# EasyEDA Pro project PRJ_Feeder_V01b.epro, board Host
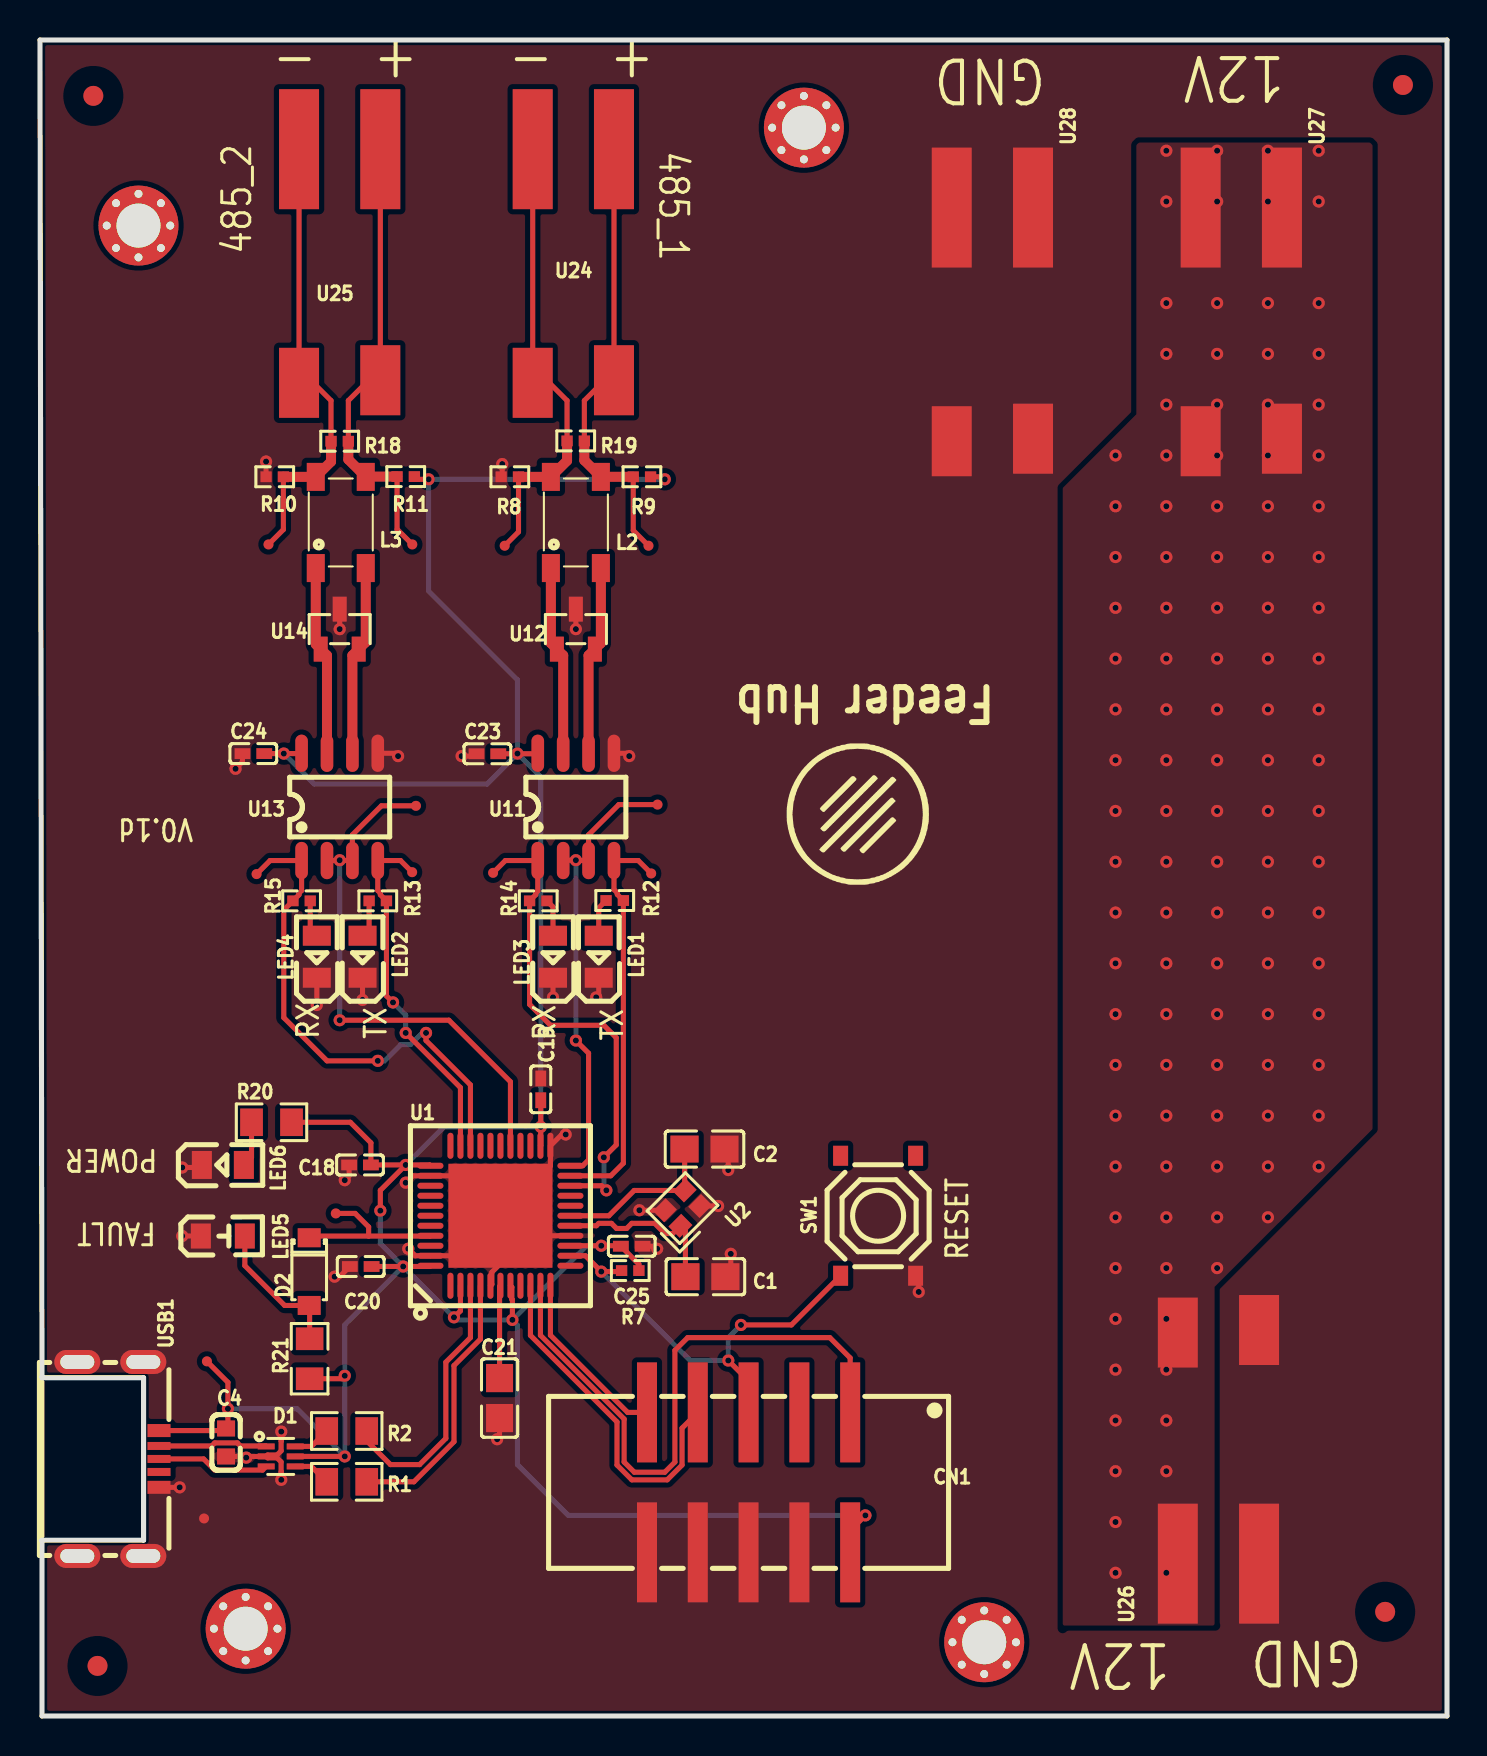
[diagram p14: board, top side]
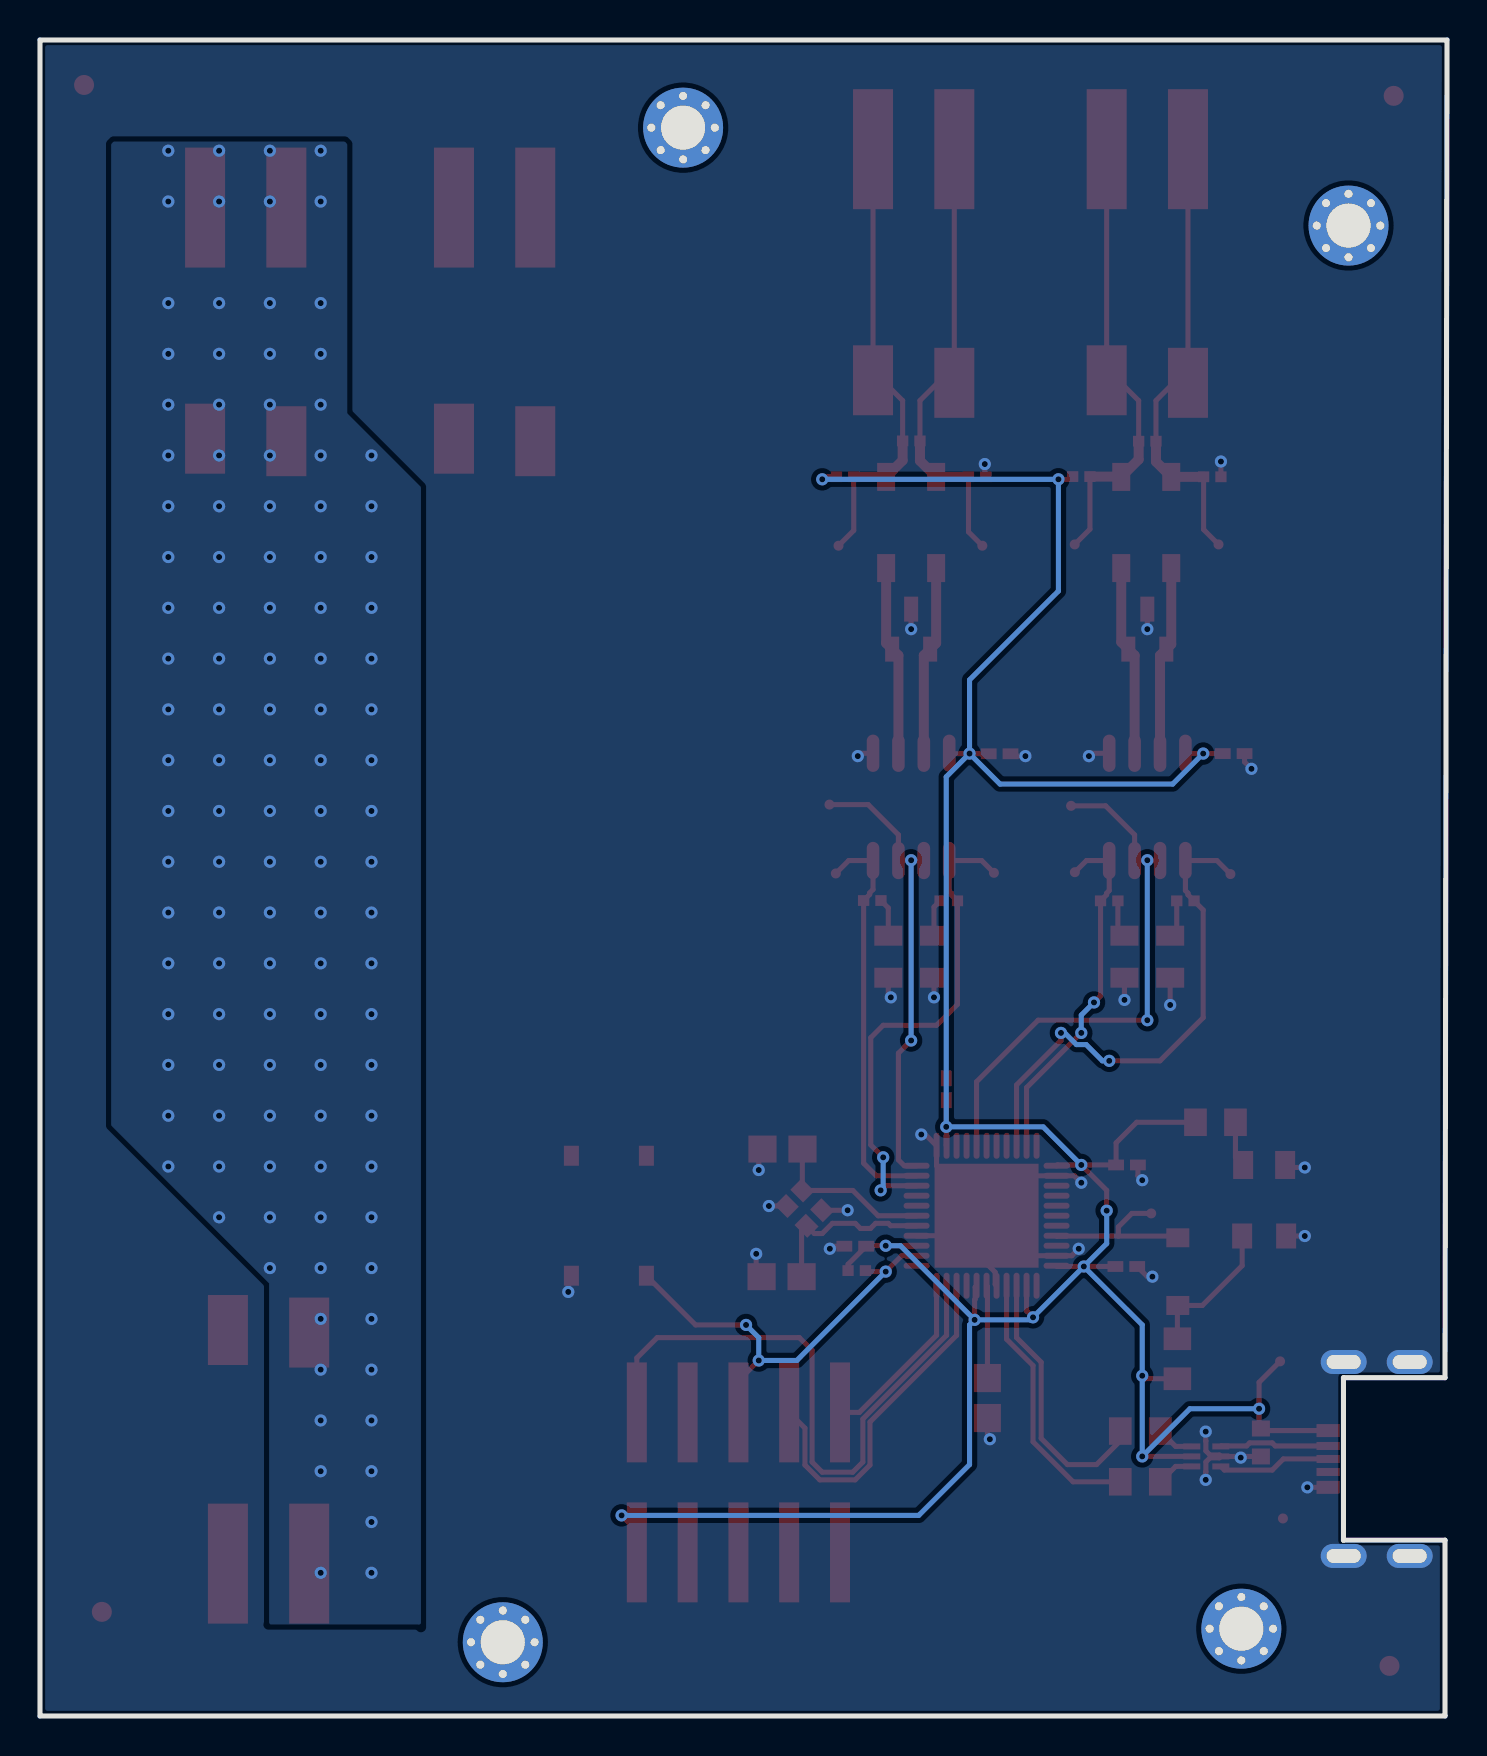
[diagram p15: board, bottom side, seen from below]

Outline 70.36 x 83.82 mm; copper layers: Top Layer, Bottom Layer. Coordinates in mm from the lower left corner of the outline.
Outline path: 0.1,16.92 0,83.82 70.36,83.82 70.36,0 0.1,0 0.1,8.79
Stack: Top Layer 0.035mm / Dielectric1 1.51mm FR4 er 4.5 / Bottom Layer 0.035mm

## Design rules (mm)
net 485_1+: 485 a
net 485_1-: 485 a
net 485_2+: 485 b
net 485_2-: 485 b
net D+: DP1
net D-: DP1
template: Custom Config
spacing copperThickness1oz (default): track to track 0.102, other pairs 0.152 to 0.3
spacing copperThickness2oz: track to track 0.203, other pairs 0.152 to 0.3
track width copperThickness1oz (default): min 0.127, default 0.254, max 2.54
track width copperThickness2oz: min 0.203, default 0.254, max 2.54
differential pair differentialPair (default): width min 0.127, default 0.254, max 2.54; gap min 0.152, default 0.152
via viaSize (default): diameter min 0.5, default 0.61, max 10; hole min 0.3, default 0.305, max 6.3
pour e1267 uses copperRegion
pour e1228 uses copperRegion

## Placement (name value [footprint] x y rotation side)
C1  14pF  [C0805]  33.27 21.97 0 top
C2  14pF  [C0805]  33.23 28.35 0 top
C4  10uF  [C0603]  9.3 13.68 90 top
C18  100nF  [C0402]  16 27.56 0 top
C19  100nF  [C0402]  25.04 31.34 270 top
C20  100nF  [C0402]  16.04 22.48 0 top
C21  1uF  [C0805]  22.98 15.9 90 top
C23  100nF  [C0402]  22.37 48.12 0 top
C24  100nF  [C0402]  10.67 48.13 0 top
C25  100nF  [C0402]  29.59 23.5 180 top
CN1  B-3000N10P-0110  [CONN-SMD_10P-P2.54_B-3000N10P-0110]  35.43 11.68 180 top
D1  USBLC6-2P6  [SOT-666-6_L1.6-W1.2-P0.50-LS1.6-BR]  12.04 12.98 180 top
D2  1N4148W  [SOD-123_L2.8-W1.8-LS3.7-RD]  13.46 22.22 270 top
H1  -  [M2]  4.92 74.54 0 top
H2  -  [M2]  38.2 79.44 0 top
H3  -  [M2]  47.22 3.69 0 top
H4  -  [M2]  10.28 4.37 0 top
L2  ACT45B-510-2P-TL003  [IND-SMD_4P-L4.5-W3.2-TL]  26.8 59.69 90 top
L3  ACT45B-510-2P-TL003  [IND-SMD_4P-L4.5-W3.2-TL]  15.04 59.69 90 top
LED1  NCD0805R1  [LED0805-R-RD]  27.94 37.97 90 top
LED2  NCD0805R1  [LED0805-R-RD]  16.13 37.97 90 top
LED3  NCD0805G1  [LED0805-R-RD]  25.65 37.97 90 top
LED4  NCD0805G1  [LED0805-R-RD]  13.84 37.97 90 top
LED5  SZYY0805Y  [LED0805-RD_YELLOW]  9.14 24 0 top
LED6  NCD0805G1  [LED0805-R-RD]  9.14 27.56 0 top
R1  22Ω  [R0805]  15.34 11.71 0 top
R2  22Ω  [R0805]  15.34 14.25 0 top
R7  10kΩ  [R0402]  29.52 22.28 180 top
R8  10kΩ  [R0402]  23.49 61.98 0 top
R9  10kΩ  [R0402]  30.1 61.98 0 top
R10  10kΩ  [R0402]  11.74 61.98 0 top
R11  10kΩ  [R0402]  18.29 61.98 0 top
R12  1kΩ  [R0402]  28.74 40.78 0 top
R13  1kΩ  [R0402]  16.89 40.77 0 top
R14  1kΩ  [R0402]  24.92 40.77 180 top
R15  1kΩ  [R0402]  13.08 40.77 180 top
R18  120Ω  [R0402]  14.99 63.75 0 top
R19  120Ω  [R0402]  26.79 63.77 0 top
R20  2kΩ  [R0805]  11.58 29.69 0 top
R21  2kΩ  [R0805]  13.48 17.87 270 top
SW1  TS-1187A-B-A-B  [SW-SMD_4P-L5.1-W5.1-P3.70-LS6.5-TL_H1.5]  41.91 25.02 90 top
TP1  -  [Test-Point-0.5mm]  14.79 25.14 0 top
TP2  -  [Test-Point-0.5mm]  8.35 17.74 0 top
TP3  -  [Test-Point-0.5mm]  8.2 9.88 0 top
TP4  -  [Test-Point-0.5mm]  30.43 58.53 270 top
TP5  -  [Test-Point-0.5mm]  23.24 58.53 270 top
TP6  -  [Test-Point-0.5mm]  30.56 42.14 0 top
TP7  -  [Test-Point-0.5mm]  22.66 42.17 0 top
TP8  -  [Test-Point-0.5mm]  30.88 45.58 0 top
TP9  -  [Test-Point-0.5mm]  18.61 42.2 0 top
TP10  -  [Test-Point-0.5mm]  10.83 42.11 0 top
TP11  -  [Test-Point-0.5mm]  18.8 45.52 0 top
TP12  -  [Test-Point-0.5mm]  18.62 58.59 270 top
TP13  -  [Test-Point-0.5mm]  11.43 58.59 270 top
U1  ATMEGA32U4-MU  [VQFN-44_L7.0-W7.0-P0.50-BL-EP5.2]  23.02 25.02 0 top
U2  16MHz  [CRYSTAL-SMD_4P-L2.0-W1.6-BL]  32.13 25.4 45 top
U11  MAX1487EDTR(XBLW)  [SOP-8_L4.9-W3.9-P1.27-LS6.0-BL]  26.8 45.47 0 top
U12  PESD2CAN-ES  [SOT-23-3_L2.9-W1.3-P1.90-LS2.4-BR]  26.8 54.36 270 top
U13  MAX1487EDTR(XBLW)  [SOP-8_L4.9-W3.9-P1.27-LS6.0-BL]  14.99 45.47 0 top
U14  PESD2CAN-ES  [SOT-23-3_L2.9-W1.3-P1.90-LS2.4-BR]  14.99 54.36 270 top
U20  -  [FID_CUST]  2.88 2.51 0 top
U21  -  [FID_CUST]  67.27 5.21 0 top
U22  -  [FID_CUST]  68.15 81.57 0 top
U23  -  [FID_CUST]  2.67 81.03 0 top
U24  -  [Wago 2060-472/998-404]  30.61 81.28 270 top
U25  -  [Wago 2060-472/998-404]  18.92 81.28 270 top
U26  -  [Wago 2060-472/998-404]  54.99 4.7 90 top
U27  -  [Wago 2060-472/998-404]  64.01 78.36 270 top
U28  -  [Wago 2060-472/998-404]  51.56 78.36 270 top
USB1  920-F62A2021S10104  [MINI-USB-SMD_920-F62A2021S10104]  3.91 12.86 270 top

## Footprints (pads in the part's own frame, mm; a bottom-side part is the same pattern mirrored in y, then rotated)
C0402
  rect 0.79x0.54 smd: 1(-0.545,0) 2(0.545,0)
C0603
  rect 0.8x0.9 smd: 1(-0.7,0) 2(0.7,0)
C0805
  rect 1.41x1.35 smd: 1(-1,0) 2(1,0)
CONN-SMD_10P-P2.54_B-3000N10P-0110
  rect 1x5 smd: 1(-5.08,-3.5) 2(-5.08,3.5) 3(-2.54,-3.5) 4(-2.54,3.5) 5(0,-3.5) 6(0,3.5) 7(2.54,-3.5) 8(2.54,3.5) 9(5.08,-3.5) 10(5.08,3.5)
CRYSTAL-SMD_4P-L2.0-W1.6-BL
  rect 0.9x0.8 smd: 1(-0.7,-0.55) 2(0.7,-0.55) 3(0.7,0.55) 4(-0.7,0.55)
FID_CUST
  round 1 smd: 1(0,0)
IND-SMD_4P-L4.5-W3.2-TL
  rect 1.4x0.9 smd: 1(-2.28,1.25) 2(-2.28,-1.25) 3(2.28,-1.25) 4(2.28,1.25)
LED0805-R-RD
  rect 1x1.399 smd: 1(1.05,0) 2(-1.05,0)
LED0805-RD_YELLOW
  rect 1x1.25 smd: 1(-1.1,0) 2(1.1,0)
M2
  round 0.61 hole 0.4: 1(0,1.588) 2(1.123,1.123) 3(1.588,0) 4(1.123,-1.123) 5(0,-1.588) 6(-1.123,-1.123) 7(-1.588,0) 8(-1.123,1.123)
  round 4 hole 2.2: 9(0,0)
MINI-USB-SMD_920-F62A2021S10104
  rect 0.65x1.15 smd: 1(-1.42,2.042) 5(1.419,2.042)
  rect 0.4x1.15 smd: 2(-0.65,2.042) 3(0,2.042) 4(0.65,2.042)
  oval 1.2x2.3 hole 0.7x1.7: 6(4.85,1.258) 7(4.85,-2.042) 8(-4.85,-2.042) 9(-4.85,1.258)
R0402
  rect 0.566x0.54 smd: 1(-0.433,0) 2(0.433,0)
R0805
  rect 1.133x1.377 smd: 1(-1,0) 2(1,0)
SOD-123_L2.8-W1.8-LS3.7-RD
  rect 0.95x1.15 smd: 1(-1.692,0) 2(1.692,0)
SOP-8_L4.9-W3.9-P1.27-LS6.0-BL
  oval 0.63x1.865 smd: 1(-1.905,-2.683) 2(-0.635,-2.683) 3(0.635,-2.683) 4(1.905,-2.683) 5(1.905,2.683) 6(0.635,2.683) 7(-0.635,2.683) 8(-1.905,2.683)
SOT-23-3_L2.9-W1.3-P1.90-LS2.4-BR
  rect 1.25x0.7 smd: 1(1,-0.95) 2(1,0.95) 3(-1,0)
SOT-666-6_L1.6-W1.2-P0.50-LS1.6-BR
  rect 0.85x0.3 smd: 1(0.725,-0.5) 2(0.725,0) 3(0.725,0.5) 4(-0.725,0.5) 5(-0.725,0) 6(-0.725,-0.5)
SW-SMD_4P-L5.1-W5.1-P3.70-LS6.5-TL_H1.5
  rect 1x0.75 smd: 1(-3,1.875) 2(3,1.875) 3(-3,-1.875) 4(3,-1.875)
Test-Point-0.5mm
  round 0.5 smd: 1(0,0)
VQFN-44_L7.0-W7.0-P0.50-BL-EP5.2
  oval 0.3x1.3 smd: 1(-2.5,-3.5) 2(-2,-3.5) 3(-1.5,-3.5) 4(-1,-3.5) 5(-0.5,-3.5) 6(0,-3.5) 7(0.5,-3.5) 8(1,-3.5) 9(1.5,-3.5) 10(2,-3.5) 11(2.5,-3.5) 23(2.5,3.5) 24(2,3.5) 25(1.5,3.5) 26(1,3.5) 27(0.5,3.5) 28(0,3.5) 29(-0.5,3.5) 30(-1,3.5) 31(-1.5,3.5) 32(-2,3.5) 33(-2.5,3.5)
  oval 1.3x0.3 smd: 12(3.5,-2.5) 13(3.5,-2) 14(3.5,-1.5) 15(3.5,-1) 16(3.5,-0.5) 17(3.5,0) 18(3.5,0.5) 19(3.5,1) 20(3.5,1.5) 21(3.5,2) 22(3.5,2.5) 34(-3.5,2.5) 35(-3.5,2) 36(-3.5,1.5) 37(-3.5,1) 38(-3.5,0.5) 39(-3.5,0) 40(-3.5,-0.5) 41(-3.5,-1) 42(-3.5,-1.5) 43(-3.5,-2) 44(-3.5,-2.5)
  rect 5.2x5.2 smd: 45(0,0)
Wago 2060-472/998-404
  rect 6x2 smd: 1(2.921,-1.905) 2(2.921,-5.969)
  rect 3.5x2 smd: 1(14.478,-1.905) 2(14.605,-5.969)

## Nets
As in the schematic.

Pads without a net: CN1 3; H1 1 2 3 4 5 6 7 8 9; H2 1 2 3 4 5 6 7 8 9; H3 1 2 3 4 5 6 7 8 9; H4 1 2 3 4 5 6 7 8 9; SW1 2 4; U1 1 8 12 18 19 25 26 28 29 30 33 36 37 38 39 40 42; U20 1; U21 1; U22 1; U23 1; USB1 4

## Via types
v1: diameter 0.61, hole 0.305, Top Layer to Bottom Layer, 171 vias

## Routing (per net, layer and track width the routed paths; a pad name or vN(x,y) marks a point on that pad's centre or on a via; arc(x,y) is an arc through that point)
5V: length 169.4
  Top Layer w0.254: v1(18.29,27.56) 19.48,27.56 U1.34 ; v1(18.29,27.56) C18.2 16.55,28.66 15.52,29.69 R20.2 ; v1(18.29,27.56) 17.02,26.29 v1(17.02,25.27) ; U1.44 19.49,22.48 v1(18.16,22.48) C20.2 ; v1(41.27,10.03) 40.51,9.27 40.51,8.18 ; R21.2 15.09,16.87 v1(15.24,17.02) ; TP2.1 9.4,16.69 v1(9.4,15.37) 9.4,14.47 C4.2 9.2,14.28 USB1.1 ; R11.2 18.86,61.85 v1(19.43,61.85) ; U1.24 25.04,28.53 v1(25.04,29.46) C19.2 ; v1(31.24,61.85) 31.11,61.98 R9.2 ; v1(20.7,19.94) 21.02,20.26 U1.2 ; 11.21,48.13 v1(12.19,48.13) 13.07,48.13 U13.8 ; U1.7 23.6,21.45 23.6,20.84 23.62,20.81 v1(23.62,19.81) ; D1.5 v1(15.24,12.98) ; C23.2 24.87,48.12 U11.8 ; R7.1 29.95,22.59 C25.2 29.02,23.52 v1(28.07,23.52) U1.14
  Bottom Layer w0.254: v1(23.88,48.13) 25.04,46.97 v1(25.04,29.46) 20.19,29.46 v1(18.29,27.56) ; v1(23.88,48.13) 23.88,51.82 19.43,56.26 v1(19.43,61.85) v1(31.24,61.85) ; v1(23.88,48.13) 22.35,46.61 13.72,46.61 v1(12.19,48.13) ; v1(23.62,19.81) 23.88,19.56 23.88,12.57 26.42,10.03 v1(41.27,10.03) ; v1(23.62,19.81) 27.33,23.52 v1(28.07,23.52) ; v1(23.62,19.81) 20.83,19.81 v1(18.16,22.48) ; v1(18.16,22.48) 17.02,23.62 v1(17.02,25.27) ; v1(18.16,22.48) 15.24,19.56 v1(15.24,17.02) v1(15.24,12.98) 12.86,15.37 v1(9.4,15.37)
12V:
  vias: v1(53.78,63.04) v1(53.78,60.5) v1(53.78,57.96) v1(53.78,55.42) v1(53.78,52.88) v1(53.78,50.34) v1(53.78,47.8) v1(53.78,45.26) v1(53.78,42.72) v1(53.78,40.18) v1(53.78,37.64) v1(53.78,35.1) v1(53.78,32.56) v1(53.78,30.02) v1(53.78,27.48) v1(53.78,24.94) v1(53.78,22.4) v1(53.78,19.86) v1(53.78,17.32) v1(53.78,14.78) v1(53.78,12.24) v1(53.78,9.7) v1(53.78,7.16) v1(56.32,78.28) v1(56.32,75.74) v1(56.32,70.66) v1(56.32,68.12) v1(56.32,65.58) v1(56.32,63.04) v1(56.32,60.5) v1(56.32,57.96) v1(56.32,55.42) v1(56.32,52.88) v1(56.32,50.34) v1(56.32,47.8) v1(56.32,45.26) v1(56.32,42.72) v1(56.32,40.18) v1(56.32,37.64) v1(56.32,35.1) v1(56.32,32.56) v1(56.32,30.02) v1(56.32,27.48) v1(56.32,24.94) v1(56.32,22.4) v1(56.32,19.86) v1(56.32,17.32) v1(56.32,14.78) v1(56.32,12.24) v1(56.32,7.16) v1(58.86,78.28) v1(58.86,75.74) v1(58.86,70.66) v1(58.86,68.12) v1(58.86,65.58) v1(58.86,63.04) v1(58.86,60.5) v1(58.86,57.96) v1(58.86,55.42) v1(58.86,52.88) v1(58.86,50.34) v1(58.86,47.8) v1(58.86,45.26) v1(58.86,42.72) v1(58.86,40.18) v1(58.86,37.64) v1(58.86,35.1) v1(58.86,32.56) v1(58.86,30.02) v1(58.86,27.48) v1(58.86,24.94) v1(58.86,22.4) v1(61.4,78.28) v1(61.4,75.74) v1(61.4,70.66) v1(61.4,68.12) v1(61.4,65.58) v1(61.4,63.04) v1(61.4,60.5) v1(61.4,57.96) v1(61.4,55.42) v1(61.4,52.88) v1(61.4,50.34) v1(61.4,47.8) v1(61.4,45.26) v1(61.4,42.72) v1(61.4,40.18) v1(61.4,37.64) v1(61.4,35.1) v1(61.4,32.56) v1(61.4,30.02) v1(61.4,27.48) v1(61.4,24.94) v1(63.94,78.28) v1(63.94,75.74) v1(63.94,70.66) v1(63.94,68.12) v1(63.94,65.58) v1(63.94,63.04) v1(63.94,60.5) v1(63.94,57.96) v1(63.94,55.42) v1(63.94,52.88) v1(63.94,50.34) v1(63.94,47.8) v1(63.94,45.26) v1(63.94,42.72) v1(63.94,40.18) v1(63.94,37.64) v1(63.94,35.1) v1(63.94,32.56) v1(63.94,30.02) v1(63.94,27.48)
GND: length 53.7
  Top Layer w0.254: U2.4 v1(29.97,25.29) ; v1(18.29,26.67) 18.64,27.02 21.02,27.02 23.02,25.02 ; LED6.2 7.97,27.43 v1(7.11,27.43) ; v1(21.08,48.01) 21.71,48.01 C23.1 ; v1(18.42,23.37) 18.77,23.02 21.02,23.02 23.02,25.02 ; LED3.2 v1(25.65,35.94) ; U13.5 17.76,48.15 v1(17.91,48.01) ; 26.52,24.02 24.02,24.02 23.02,25.02 ; v1(26.29,29.08) 26.09,29.08 U1.23 25.52,27.52 23.02,25.02 ; SW1.3 43.94,21.86 v1(43.94,21.21) ; 23.02,25.02 23.02,22.62 22.6,22.2 22.6,21.59 U1.5 ; R10.1 v1(11.31,62.74) ; C4.1 11.31,12.98 D1.2 ; v1(29.46,48.01) 29.32,48.15 U11.5 ; LED2.2 v1(16.13,35.81) ; v1(14.73,21.97) 14.98,21.97 C20.1 ; U14.3 v1(14.99,54.36) ; 5.95,11.44 v1(6.98,11.44) ; v1(9.78,47.37) 10.12,47.72 C24.1 ; C25.1 30.73,23.5 v1(30.86,23.37) ; C1.2 34.54,22.24 v1(34.54,23.11) ; v1(12.06,14.22) 12.06,13.76 12.06,13.75 12.06,13.26 11.85,13.05 11.38,13.05 D1.2 ; R8.1 23.11,62.03 v1(23.11,62.61) ; LED1.2 27.94,36.07 v1(27.81,35.94) ; D1.2 11.38,12.91 11.85,12.91 12.06,12.71 12.06,12.22 12.06,12.21 v1(12.06,11.81) ; v1(22.86,13.84) 22.98,13.96 C21.1 ; LED5.1 v1(7.11,24) ; 33.02,25.51 v1(33.91,25.51) ; LED4.2 v1(13.84,35.56) ; C18.1 15.46,27.01 v1(15.24,26.8) ; U12.3 v1(26.8,54.36) ; C2.2 34.42,28.17 v1(34.42,27.3)
  vias: v1(10.31,12.92)
485_1+: length 23
  Top Layer w0.254: R9.1 29.67,59.29 TP4.1 ; U24.1 28.7,66.8 28.24,66.8 27.22,65.79 27.22,63.77
  Top Layer w0.5: 27.22,63.77 27.22,62.8 L2.3 28.05,61.98 R9.1
485_1-: length 23.3
  Top Layer w0.254: R19.1 26.36,65.79 25.47,66.67 U24.2 U24.2 ; TP5.1 23.93,59.22 R8.2
  Top Layer w0.5: R19.1 26.36,62.78 L2.4 23.93,61.97 R8.2
485_2+: length 23
  Top Layer w0.254: U25.1 17.02,66.8 16.44,66.8 15.42,65.79 R18.2 ; TP12.1 17.86,59.35 17.86,61.98
  Top Layer w0.5: 17.86,61.98 16.31,61.98 L3.3 15.42,62.84 R18.2
485_2-: length 23.1
  Top Layer w0.254: 12.17,61.98 12.17,59.34 TP13.1 ; R18.1 14.55,65.79 13.66,66.67 U25.2 U25.2
  Top Layer w0.5: 12.17,61.98 12.18,61.97 L3.4 14.55,62.73 R18.1
CLK: length 17.6
  Top Layer w0.254: U1.9 24.52,19.04 28.85,14.71 28.85,12.55 29.6,11.81 31.36,11.81 32.11,12.55 32.11,14.4 CN1.7
D+: length 13.5
  Top Layer w0.254: U1.4 22.02,18.85 20.7,17.53 20.7,13.72 18.7,11.71 R1.2
D-: length 13.6
  Top Layer w0.254: U1.3 21.52,18.92 20.29,17.69 20.29,13.88 18.98,12.57 17.53,12.57 16.34,13.76 R2.2
DI1: length 20.4
  Top Layer w0.254: TP6.1 29.92,42.78 U11.4 28.7,41.33 28.87,41.17 28.87,41.09 R12.2 29.17,27.65 28.54,27.02 26.52,27.02
DI2: length 17.9
  Top Layer w0.254: v1(18.29,34.16) 21.02,31.43 U1.32 ; v1(17.65,35.69) 17.32,36.02 R13.2 17.02,41.07 17.02,41.15 16.89,41.28 U13.4 18.03,42.78 TP9.1
  Bottom Layer w0.254: v1(17.65,35.69) 18.29,35.05 v1(18.29,34.16)
FAULT: length 8.5
  Top Layer w0.254: 16.43,24 13.55,24 D2.1 ; 16.43,24 16.43,24.46 15.76,25.14 TP1.1 ; 16.43,24 19.51,24 19.52,24.02
MISO: length 8.9
  Top Layer w0.254: CN1.9 29.38,15.18 25.52,19.04 U1.11
MOSI: length 31.3
  Top Layer w0.254: U1.10 25.02,19.04 29.21,14.85 29.21,12.7 29.72,12.19 31.24,12.19 31.75,12.7 31.75,18.29 32.39,18.92 39.5,18.92 40.51,17.91 40.51,15.18
RE1: length 22.9
  Top Layer w0.254: TP8.1 28.95,45.58 27.43,44.07 U11.3 26.81,42.78 v1(26.8,42.8) 26.18,42.8 U11.2 ; U1.22 27.14,27.52 27.43,27.81 27.43,33.15 v1(26.8,33.78)
  Bottom Layer w0.254: v1(26.8,33.78) v1(26.8,42.8)
RE2: length 27.4
  Top Layer w0.254: U13.2 15.62,42.78 15.62,44.07 17.07,45.52 TP11.1 ; U1.27 23.52,31.72 20.45,34.8 v1(14.99,34.8)
  Bottom Layer w0.254: v1(14.99,34.8) v1(14.99,42.8)
RO1: length 24.7
  Top Layer w0.254: v1(28.32,26.29) 28.09,26.52 U1.20 ; v1(28.19,27.94) 28.82,28.56 28.82,33.92 28.19,34.54 25.53,34.54 24.48,35.59 R14.2 24.79,41.07 24.79,41.15 24.89,41.26 U11.1 23.27,42.78 TP7.1
  Bottom Layer w0.254: v1(28.19,27.94) 28.19,26.42 v1(28.32,26.29)
RO2: length 25.9
  Top Layer w0.254: U1.31 21.52,31.56 19.3,33.78 v1(19.3,34.16) ; v1(16.89,32.77) 14.35,32.77 12.19,34.92 12.19,40.31 R15.2 12.95,41.07 12.95,41.15 13.08,41.28 U13.1 11.51,42.78 TP10.1
  Bottom Layer w0.254: v1(19.3,34.16) 19.11,34.16 18.53,33.58 18.05,33.58 17.23,32.77 v1(16.89,32.77)
RST: length 22.2
  Top Layer w0.254: v1(34.42,17.78) 35.43,16.76 CN1.5 ; SW1.1 37.57,19.56 v1(35.05,19.56) ; R7.2 29.03,22.22 v1(28.07,22.22) 27.27,23.02 26.52,23.02
  Bottom Layer w0.254: v1(35.05,19.56) 34.42,18.92 v1(34.42,17.78) 32.51,17.78 v1(28.07,22.22)
X1: length 8.3
  Top Layer w0.254: C2.1 32.24,28.35 32.24,26.28 29.71,26.28 28.45,25.02 26.52,25.02
X2: length 8.8
  Top Layer w0.254: C1.1 32.27,24.27 U2.1 31.64,24.13 31.24,24.13 30.73,24.64 29.59,24.64 29.34,24.38 28.83,24.38 28.58,24.64 27.94,24.64 27.82,24.52 U1.16
$1N1505: length 5.7
  Top Layer w0.254: D1.3 11.13,12.3 8.74,12.3 8.18,12.86 USB1.3
$1N1514: length 5.5
  Top Layer w0.254: USB1.2 8.59,13.51 8.74,13.66 9.87,13.66 10.02,13.51 11.29,13.51 D1.1
$1N1660: length 1.9
  Top Layer w0.254: R2.1 13.57,13.48 D1.6
$1N1664: length 1.9
  Top Layer w0.254: D1.4 13.57,12.48 R1.1
$1N2192: length 4.6
  Top Layer w0.254: U1.6 22.98,21.47 C21.2
$1N4732: length 7.2
  Top Layer w0.254: R21.1 13.48,20.51 D2.2 12.23,20.53 10.24,22.52 LED5.2
$1N4906: length 2.3
  Top Layer w0.254: R20.1 10.58,27.94 LED6.1
$2N403: length 9.5
  Top Layer w0.5: L2.1 25.55,53.66 U12.1 26.16,53.04 U11.7
$2N410: length 9.5
  Top Layer w0.5: U11.6 27.43,53.04 U12.2 28.05,53.66 L2.2
$2N418: length 9.5
  Top Layer w0.5: L3.1 13.79,53.6 U14.1 14.35,53.04 U13.7
$2N431: length 9.5
  Top Layer w0.5: 15.62,48.15 15.62,53.04 U14.2 16.29,53.71 L3.2
$2N1218: length 1.9
  Top Layer w0.254: R12.1 27.94,40.42 LED1.1
$2N1337: length 1.9
  Top Layer w0.254: R13.1 16.46,39.35 LED2.1
$2N1473: length 1.9
  Top Layer w0.254: LED3.1 25.65,40.46 R14.1
$2N1588: length 1.9
  Top Layer w0.254: R15.1 13.51,39.35 LED4.1

## Copper pours and planes (outline as drawn; the poured copper is in the pictures)
12V on Top Layer: 58.76,4.52 51.27,4.52 51.14,4.4 51.14,61.42 54.82,65.1 54.82,78.56 54.95,78.69 66.51,78.69 66.64,78.56 66.64,29.36 58.73,21.46 58.73,4.55
12V on Bottom Layer: 58.93,4.57 51.44,4.57 51.31,4.44 51.31,61.47 54.99,65.15 54.99,78.61 55.12,78.74 66.67,78.74 66.8,78.61 66.8,29.53 58.9,21.63 58.9,4.6
GND on Top Layer: 0.1,83.82 70.36,83.82 70.36,0 0.1,0
GND on Bottom Layer: 0.1,83.82 70.36,83.82 70.36,0 0.1,0

## Text on the board
Top Silkscreen Layer: RX / TX | RESET | FAULT | POWER | V0.1d | 485_1 | 485_2 | Feeder Hub | +  - | GND | 12V
